# Altium project NeoPixel (ws2812) LED Matrix - 8x8.PrjPcb
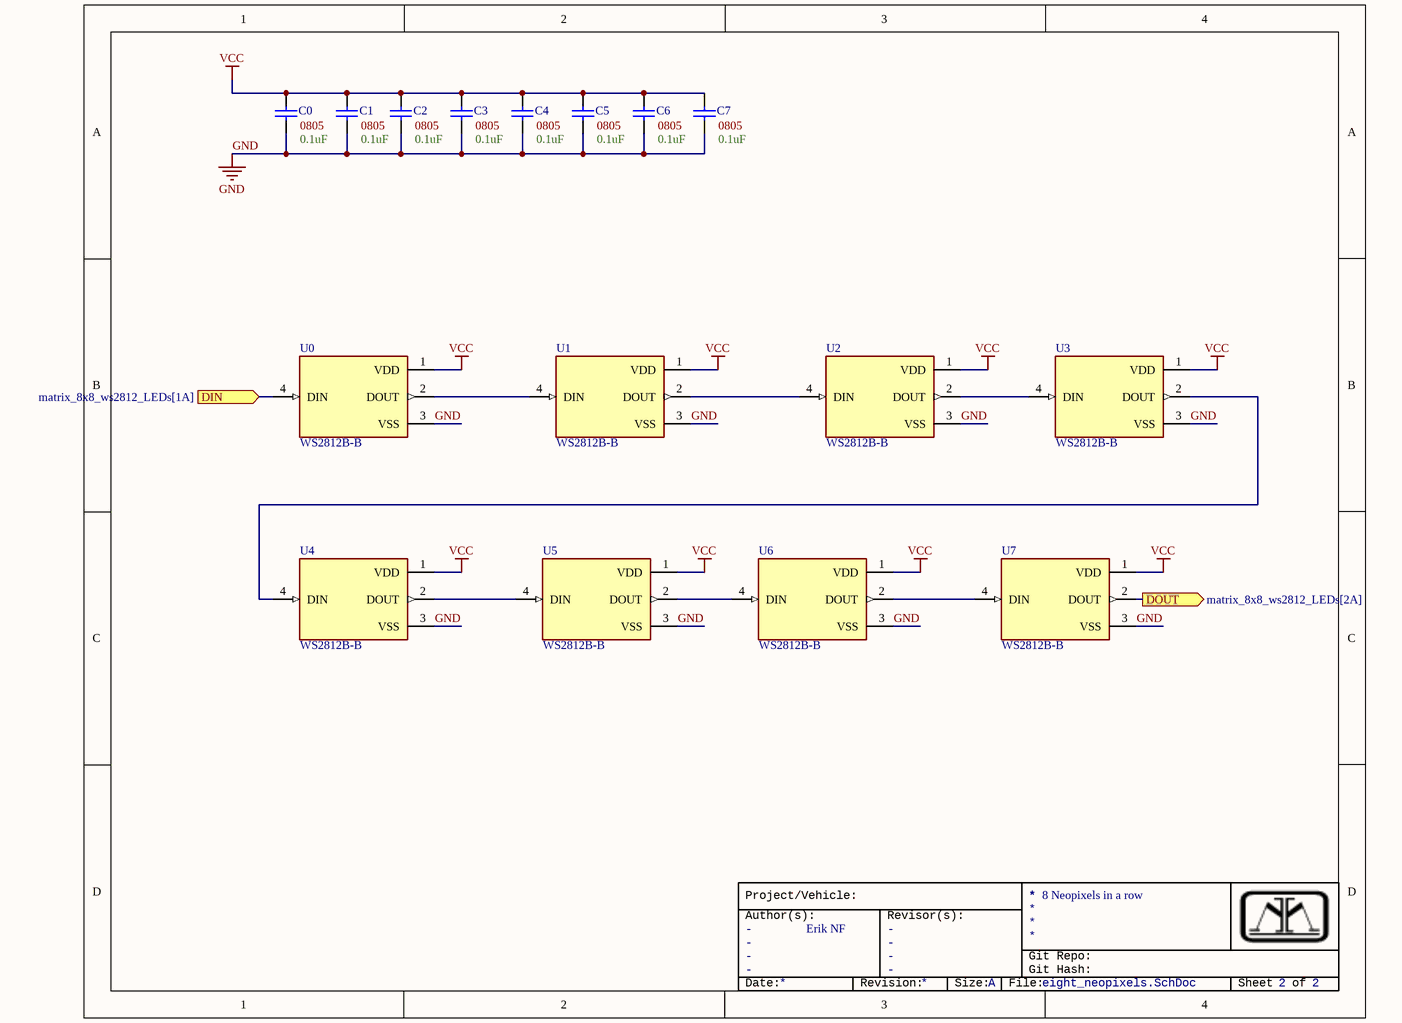
[diagram p0: eight_neopixels.SchDoc]
1 sheet, 16 parts. Net scope: hierarchical (ports join the sheet entries above them; power ports are global).
Board file: matrix_8x8_ws2812_LEDs.PcbDoc

## Sheet eight_neopixels.SchDoc
size A; SheetNumber: 2; SheetTotal: 2

### Parts
C0  Size Package: 0805  Capacitance: 0.1uF  [[Cap] SMD 0805]  (hidden comment: SMD Nonpolarized)
C1  Size Package: 0805  Capacitance: 0.1uF  [[Cap] SMD 0805]  (hidden comment: SMD Nonpolarized)
C2  Size Package: 0805  Capacitance: 0.1uF  [[Cap] SMD 0805]  (hidden comment: SMD Nonpolarized)
C3  Size Package: 0805  Capacitance: 0.1uF  [[Cap] SMD 0805]  (hidden comment: SMD Nonpolarized)
C4  Size Package: 0805  Capacitance: 0.1uF  [[Cap] SMD 0805]  (hidden comment: SMD Nonpolarized)
C5  Size Package: 0805  Capacitance: 0.1uF  [[Cap] SMD 0805]  (hidden comment: SMD Nonpolarized)
C6  Size Package: 0805  Capacitance: 0.1uF  [[Cap] SMD 0805]  (hidden comment: SMD Nonpolarized)
C7  Size Package: 0805  Capacitance: 0.1uF  [[Cap] SMD 0805]  (hidden comment: SMD Nonpolarized)
U0  WS2812B-B  [LED_WS2812B-B]
U1  WS2812B-B  [LED_WS2812B-B]
U2  WS2812B-B  [LED_WS2812B-B]
U3  WS2812B-B  [LED_WS2812B-B]
U4  WS2812B-B  [LED_WS2812B-B]
U5  WS2812B-B  [LED_WS2812B-B]
U6  WS2812B-B  [LED_WS2812B-B]
U7  WS2812B-B  [LED_WS2812B-B]

### Ports
DIN (in, see matrix_8x8_ws2812_LEDs[1A]), DOUT (out, see matrix_8x8_ws2812_LEDs[2A])

### Nets
GND: C0.1 C1.1 C2.1 C3.1 C4.1 C5.1 C6.1 C7.1 U0.3(VSS) U1.3(VSS) U2.3(VSS) U3.3(VSS) U4.3(VSS) U5.3(VSS) U6.3(VSS) U7.3(VSS)
VCC: C0.2 C1.2 C2.2 C3.2 C4.2 C5.2 C6.2 C7.2 U0.1(VDD) U1.1(VDD) U2.1(VDD) U3.1(VDD) U4.1(VDD) U5.1(VDD) U6.1(VDD) U7.1(VDD)
NetU0_2: U0.2(DOUT) U1.4(DIN)
NetU0_4: U0.4(DIN) ; port DIN
NetU1_2: U1.2(DOUT) U2.4(DIN)
NetU2_2: U2.2(DOUT) U3.4(DIN)
NetU3_2: U3.2(DOUT) U4.4(DIN)
NetU4_2: U4.2(DOUT) U5.4(DIN)
NetU5_2: U5.2(DOUT) U6.4(DIN)
NetU6_2: U6.2(DOUT) U7.4(DIN)
NetU7_2: U7.2(DOUT) ; port DOUT

### Notes on the sheet
- 8 Neopixels in a row
- Erik NF
- Project/Vehicle:
- Author(s):
- -
- Revisor(s):
- Git Repo:
- Git Hash:
- Date:
- Revision:
- Size:
- A
- File:
- Sheet
- of

### Library data of the parts
C0-C7 = [Cap] SMD Nonpolarized: Voltage: 6.3V; Tolerance: 10%
U0-U7 = WS2812B-B: Intelligent control LED integrated light source; Availability: Unavailable; Price: None; Package: None; MP: WS2812B-B; Value: *